# Altium project emote2-gsm_gps-project.PrjPcb
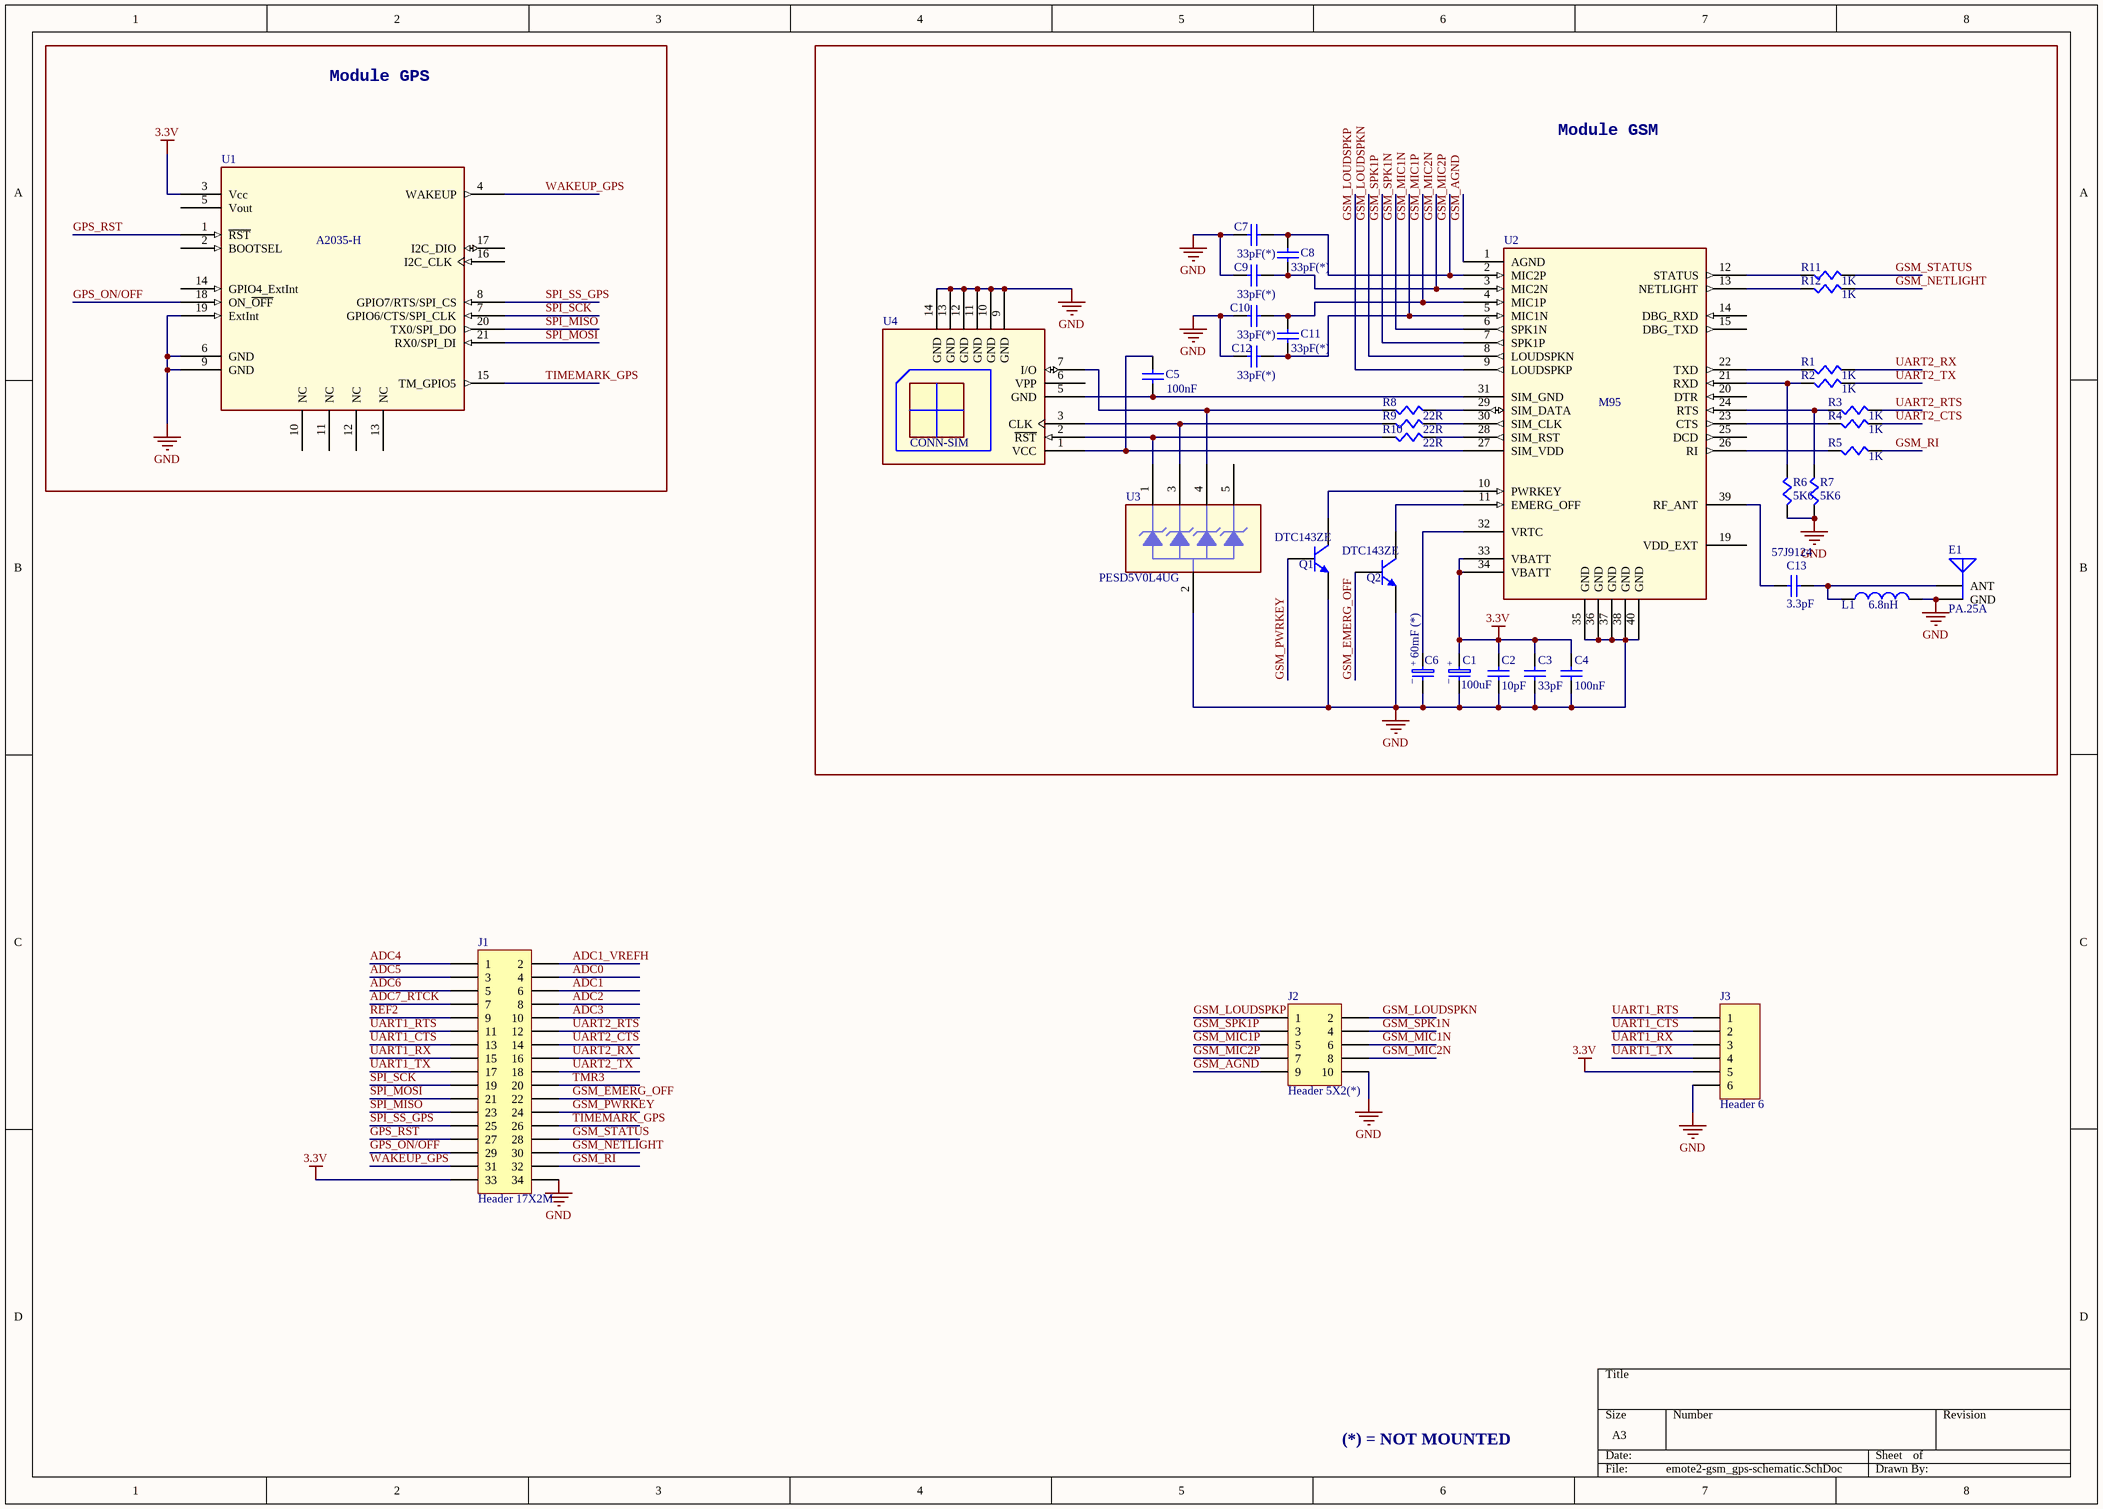
[diagram p0: emote2-gsm_gps-schematic.SchDoc]
1 sheet, 36 parts. Net scope: global (net labels, ports and power ports of the same name join across sheets).
Board file: emote2-gsm_gps-pcb_document.PcbDoc

## Sheet emote2-gsm_gps-schematic.SchDoc
size A3; PageSetup: Record=PageOptions|CenterHorizontal=True|CenterVertical=True|PrintScale=0.69|XCorrection=1.00|YCorrection=1.00|PrintKind=0|BorderSize=5000000|LeftOffset=0|BottomOffset=0|Orientation=2|PaperLength=1000|PaperWidth=1000|Scale=100|PaperSource=7|PrintQuality=-4|MediaType=1|DitherType=10|PaperKind=A4|PrintScaleMode=1

### Parts
C1  100uF  [TC3528-1411]
C2  10pF  [0603]
C3  33pF  [0603]
C4  100nF  [0603]
C5  100nF  [0603]
C6  60mF (*)  [PAS414HR-VE5R]  (no BOM)
C7  33pF(*)  [0603]  (no BOM)
C8  33pF(*)  [0603]  (no BOM)
C9  33pF(*)  [0603]  (no BOM)
C10  33pF(*)  [0603]  (no BOM)
C11  33pF(*)  [0603]  (no BOM)
C12  33pF(*)  [0603]  (no BOM)
C13  3.3pF  Supplier Part Number 1: 57J9124  [0402]
E1  PA.25A  [PA-25A_ANTENA]
J1  Header 17X2M  [FTR-117-D-BOTTOM]
J2  Header 5X2(*)  [BB080 2x5 CON]  (no BOM)
J3  Header 6  [MHDR1X6]
L1  6.8nH  [0402]
Q1  DTC143ZE  [SOT416-3L]
Q2  DTC143ZE  [SOT416-3L]
R1  1K  [0402]
R2  1K  [0402]
R3  1K  [0402]
R4  1K  [0402]
R5  1K  [0402]
R6  5K6  [0402]
R7  5K6  [0402]
R8  22R  [0402]
R9  22R  [0402]
R10  22R  [0402]
R11  1K  [0402]
R12  1K  [0402]
U1  A2035-H  [A2035-H]
U2  M95  [M95]
U3  PESD5V0L4UG  [SOT353/SC-88A]
U4  CONN-SIM  [MICRO-SIM]

### Blocks framed on the sheet
Module GPS: U1
Module GSM: C1-C13 E1 L1 Q1 Q2 R1-R12 U2-U4

### Nets
3.3V: C1.1 C2.2 C3.2 C4.2 J1.33 J3.5 U1.3(Vcc) U2.33(VBATT) U2.34(VBATT)
GND: C1.2 C2.1 C3.1 C4.1 C6.2 C7.1 C9.1 C10.1 C12.1 E1.2(GND) J1.34 J2.10 J3.6 L1.2 Q1.3(E) Q2.3(E) R6.1 R7.1 U1.6(GND) U1.9(GND) U1.19(ExtInt) U2.35(GND) U2.36(GND) U2.37(GND) U2.38(GND) U2.40(GND) U3.2 U4.9(GND) U4.10(GND) U4.11(GND) U4.12(GND) U4.13(GND) U4.14(GND)
ADC0: J1.4
ADC1: J1.6
ADC1_VREFH: J1.2
ADC2: J1.8
ADC3: J1.10
ADC4: J1.1
ADC5: J1.3
ADC6: J1.5
ADC7_RTCK: J1.7
GPS_ON/OFF: J1.29 U1.18(ON_~{OFF})
GPS_RST: J1.27 U1.1(~{RST})
GSM_AGND: J2.9 U2.1(AGND)
GSM_EMERG_OFF: J1.22 Q2.1(B)
GSM_LOUDSPKN: J2.2 U2.8(LOUDSPKN)
GSM_LOUDSPKP: J2.1 U2.9(LOUDSPKP)
GSM_MIC1N: C11.1 C12.2 J2.6 U2.5(MIC1N)
GSM_MIC1P: C10.2 C11.2 J2.5 U2.4(MIC1P)
GSM_MIC2N: C8.1 C9.2 J2.8 U2.3(MIC2N)
GSM_MIC2P: C7.2 C8.2 J2.7 U2.2(MIC2P)
GSM_NETLIGHT: J1.30 R12.2
GSM_PWRKEY: J1.24 Q1.1(B)
GSM_RI: J1.32 R5.2
GSM_SPK1N: J2.4 U2.6(SPK1N)
GSM_SPK1P: J2.3 U2.7(SPK1P)
GSM_STATUS: J1.28 R11.2
REF2: J1.9
SPI_MISO: J1.23 U1.20(TX0/SPI_DO)
SPI_MOSI: J1.21 U1.21(RX0/SPI_DI)
SPI_SCK: J1.19 U1.7(GPIO6/CTS/SPI_CLK)
SPI_SS_GPS: J1.25 U1.8(GPIO7/RTS/SPI_CS)
TIMEMARK_GPS: J1.26 U1.15(TM_GPIO5)
TMR3: J1.20
UART1_CTS: J1.13 J3.2
UART1_RTS: J1.11 J3.1
UART1_RX: J1.15 J3.3
UART1_TX: J1.17 J3.4
UART2_CTS: J1.14 R4.2
UART2_RTS: J1.12 R3.2
UART2_RX: J1.16 R1.2
UART2_TX: J1.18 R2.2
WAKEUP_GPS: J1.31 U1.4(WAKEUP)
NetC5_1: C5.1 U2.31(SIM_GND) U4.5(GND)
NetC5_2: C5.2 U2.27(SIM_VDD) U4.1(VCC)
NetC6_1: C6.1 U2.32(VRTC)
NetC13_1: C13.1 U2.39(RF_ANT)
NetC13_2: C13.2 E1.1(ANT) L1.1
NetQ1_2: Q1.2(C) U2.10(PWRKEY)
NetQ2_2: Q2.2(C) U2.11(EMERG_OFF)
NetR1_1: R1.1 U2.22(TXD)
NetR2_1: R2.1 R6.2 U2.21(RXD)
NetR3_1: R3.1 R7.2 U2.24(RTS)
NetR4_1: R4.1 U2.23(CTS)
NetR5_1: R5.1 U2.26(RI)
NetR8_1: R8.1 U3.4 U4.7(I/O)
NetR8_2: R8.2 U2.29(SIM_DATA)
NetR9_1: R9.1 U3.3 U4.3(CLK)
NetR9_2: R9.2 U2.30(SIM_CLK)
NetR10_1: R10.1 U3.1 U4.2(~{RST})
NetR10_2: R10.2 U2.28(SIM_RST)
NetR11_1: R11.1 U2.12(STATUS)
NetR12_1: R12.1 U2.13(NETLIGHT)

Not connected (* = marked no-connect by the designer): E1 3(NC) 4(NC); U1 2(BOOTSEL) 5(Vout) 10(NC) 11(NC) 12(NC) 13(NC) 14(GPIO4_ExtInt) 16(I2C_CLK) 17(I2C_DIO) 22(GND) 23(GND) 24(GND) 25(GND) 26(GND) 27(GND) 28(GND) 29(GND); U2 14(DBG_RXD) 15(DBG_TXD) 16(NC) 17(NC) 18(NC) 19(VDD_EXT) 20(DTR) 25(DCD) 41(NC) 42(NC); U3 5; U4 4(NC) 6(VPP) 8(NC)

### Notes on the sheet
- (*) = NOT MOUNTED
- (in symbol C-POL) +; _

### Library data of the parts
C1 = C-POL: Capacitor Polarised; Manufacturer: Kemet; Manufacturer Part Number: T495B107M006ATE700; Manufacturer Size Code: B; Description: CAP TANT 100UF 6.3V 20% 1411; ESR (Equivalent Series Resistance): 700 mOhm; Tolerance: ±20%; Type: Molded; Capacitance: 100µF; Voltage - Rated: 6.3V; Supplier 1: Digi-Key; Supplier Part Number 1: 399-3875-6-ND; Category: Capacitors; Supplier: Mouser; Supplier Part Number: T495B107M006ATE700; RoHS: RoHS Compliant; Mounting Type: Surface Mount; Size / Dimension: 0.138" L x 0.110" W (3.50mm x 2.80mm); Operating Temperature: -55°C ~ 125°C; Height - Seated (Max): 0.083" (2.10mm); Package / Case: 1411 (3528 Metric); Lead Spacing: -; Packaging: Cut Tape (CT); Features: General Purpose; Lifetime @ Temp.: -; Price: 1.50
C2 = C0603C10pF: CAP CERAMIC 10pF 25V X5R 0603; Manufacturer Part Number: VJ0603A100JXACW1BC; Manufacturer: VISHAY BC COMPONENTS; Capacitance: 10; Dielectric Characteristic: C0G / NP0; Voltage Rating: 50; No. of Pins: 2; Capacitance Tolerance: ± 5%; Capacitor Terminals: SMD; Capacitor Case Style: 0603 [1608 Metric]; Description: VISHAY BC COMPONENTS - VJ0603A100JXACW1BC - CAPACITOR CERAMIC 10PF 50V, C0G, 5%, 0603; Supplier: Mouser; Price: 0.06; Supplier Part Number: 77-VJ0603A100JXACBC; RoHS: YES; Supplier 1: Newark; Supplier Part Number 1: 57J8481
C3 = C0603C33pF: CAP CERAMIC 33pF 25V X5R 0603; Manufacturer: VISHAY VITRAMON; Manufacturer Part Number: VJ0603A330JXACW1BC; Description: VISHAY VITRAMON - VJ0603A330JXACW1BC - CAPACITOR CERAMIC 33PF 50V, C0G, 5%, 0603; Capacitance: 33; Dielectric Characteristic: C0G / NP0; Capacitance Tolerance: ± 5%; Capacitor Case Style: 0603 [1608 Metric]; Voltage Rating: 50; Capacitor Terminals: SMD; Supplier Part Number: 77-VJ0603A330JXACBC; Supplier: Mouser; Price: 0.06; RoHS: YES; Supplier 1: Newark; Supplier Part Number 1: 57J9194
C4 = C0603C100nF: CAP CERAMIC 100nF 6.3V X5R 0603; Manufacturer Part Number: VJ0603Y104JXJCW1BC; Manufacturer: VISHAY VITRAMON; Description: VISHAY VITRAMON - VJ0603Y104JXJAC - CAPACITOR CERAMIC, 0.1UF, 16V, X7R, 5%, 0603; Supplier Part Number: 77-VJ0603Y104JXJCBC; Supplier: Mouser; Price: 0.06; RoHS: YESX; Supplier 1: Newark; Supplier Part Number 1: 07J8667
C5 = C0603C100nF: CAP CERAMIC 100nF 6.3V X5R 0603; Manufacturer: VISHAY VITRAMON; Manufacturer Part Number: VJ0603Y104JXJCW1BC; Description: VISHAY VITRAMON - VJ0603Y104JXJAC - CAPACITOR CERAMIC, 0.1UF, 16V, X7R, 5%, 0603; RoHS: YESX; Supplier Part Number: 77-VJ0603Y104JXJCBC; Supplier: Mouser; Price: 0.06; Supplier 1: Newark; Supplier Part Number 1: 07J8667
C6 = C-POL: Capacitor Polarised; Manufacturer: TAIYO YUDEN; Description: TAIYO YUDEN - PAS414HR-VE5R - CAP,0.06F, 3.3V, 80 OHM, 4.8MM COIN; Capacitor Terminals: SMD; ESR: 80; Capacitor Case Style: Coin; Capacitance: 60000; Voltage Rating: 3.3; Supplier: Newark; RoHS: YES; Manufacturer Part Number: PAS414HR-VE5R; Supplier Part Number: 12T3294; Operating Temperature Max: 60; Operating Temperature Min: -20; Capacitance Tolerance: -; Supplier 1: Newark; Supplier Part Number 1: 12T3294; Price: 1.18
C7-C12 = CAP: Capacitor; Manufacturer Part Number: MCCA000198; Manufacturer: MULTICOMP; Description: MULTICOMP - MCCA000198 - CAP, CERAMIC, 33PF, 50V, C0G / NP0, 0603; Capacitance Tolerance: ± 5%; No. of Pins: 2; Capacitance: 33; Capacitor Terminals: SMD; Voltage Rating: 25; Dielectric Characteristic: C0G / NP0; Capacitor Case Style: 0201 [0603 Metric]; RoHS: YES; Supplier: Newark; Supplier Part Number: 33R0423; Supplier 1: Newark; Supplier Part Number 1: 33R0423
C13 = CAP: CAP CERAMIC 3.3pF 50V X5R 0402; Manufacturer: VISHAY VITRAMON; Manufacturer Part Number: VJ0603A3R3CXACW1BC; Description: VISHAY VITRAMON - VJ0603A3R3CXACW1BC - CAPACITOR CERAMIC 3.3PF 50V, C0G, 0.25pF, 0603; Capacitance Tolerance: ± 0.25; Capacitor Terminals: SMD; Capacidad: 3.3; Característica dieléctrica: C0G / NP0; N.º of Pins: 2; Capacitor Case Style: 0603 [1608 Metric]; Voltage Rating: 50; Supplier: Mouser; RoHS: YES; Supplier Part Number: 77-VJ0603A3R3CXACBC; Price: 0.06; Capacitance: 3.3; Dielectric Characteristic: C0G / NP0; Supplier 1: Newark
E1 = ANTENNA-PA25A: ANTENNA 6-BAND SMT; Manufacturer: Taoglas Limited; Gain: 1.76dBi, 4.62dBi; Frequency: 824MHz ~ 960MHz, 1.7GHz ~ 2.17GHz; VSWR: 3; Number of Bands: 6; Antenna Type: Chip; Termination: Surface Mount; RoHS: RoHS Compliant; Category: RF/IF and RFID; Packaging: Cut Tape (CT); Manufacturer Part Number: PA.25A; Height (Max): 5mm; Mounting Type: Surface Mount; Supplier 1: Digi-Key; Supplier Part Number 1: 931-1060-1-ND; Supplier: Mouser; Supplier Part Number: 960-PA25A; Price: 11.34
J1 = Header 17X2M: SAMTEC - FTR-117-03-S-D - HEADER, 1.27 X 2.54MM, SMD, 2X17POS; Pitch Spacing: 1.27; Contact Termination: Surface Mount Vertical; No. of Rows: 2; No. of Contacts: 34; Contact Plating: Gold; Series: -; Contact Material: Phosphor Bronze; Manufacturer Part Number: FTR-117-03-S-D; Gender: Header; RoHS: YES; Manufacturer: SAMTEC; Supplier Part Number: 84T3738; Supplier: Newark; Supplier 1: Newark; Supplier Part Number 1: 84T3738; Price: 5.64
J2 = Header 5X2: Header, 5-Pin, Dual row; Manufacturer: GLOBAL CONNECTOR TECHNOLOGY; Manufacturer Part Number: BB080-10-A-0-0270-0150-L-D; Description: GLOBAL CONNECTOR TECHNOLOGY - BB080-10-A-0-0270-0150-L-D - BOARD-BOARD CONN, HEADER, 10WAY, 2ROW; Supplier Part Number: 67R6815; RoHS: YES; Supplier: Newark; Supplier 1: Newark; Supplier Part Number 1: 67R6815
J3 = Header 6: Header, 6-Pin; Manufacturer Part Number: BD020-06-A-J-0350-0300-L-G; Manufacturer: GLOBAL CONNECTOR TECHNOLOGY; Description: GLOBAL CONNECTOR TECHNOLOGY - BD020-06-A-J-0350-0300-L-G - BOARD-BOARD CONNECTOR HEADER, 6WAY, 1ROW; No. of Contacts: 6; No. of Rows: 1; Pitch Spacing: 1.27; Contact Termination: Through Hole Vertical; Series: -; Supplier Part Number: 67R7288; Supplier: Newark; Gender: Header; RoHS: YES; Contact Plating: Gold; Contact Material: Copper Alloy; Supplier 1: Newark; Supplier Part Number 1: 67R7288; Price: 0.45
L1 = 74477420: INDUCTOR POWER 100UH .57A SMD; Manufacturer: TAIYO YUDEN; Manufacturer Part Number: HK10056N8J-T; Description: TAIYO YUDEN - HK10056N8J-T - SMD INDUCTOR, 6.8NH 180MA 5% 5.5GHZ; Supplier Part Number: 963-HK10056N8J-T; Supplier: Mouser; Supplier 1: Newark; Supplier Part Number 1: 86H5548; RoHS: YES; Price: 0.05
Q1 Q2 = T-DTC143Z: NPN General Purpose Amplifier; Manufacturer Part Number: PDTC143ZE,115; Manufacturer: NXP; Description: NXP - PDTC143ZE,115 - BRT TRANSISTOR, NPN, 50V, 100MA, 4.7KOHM / 47KOHM, 3-SOT-416; Resistor Ratio, R1 / R2: 10; Base Input Resistor R1: 4.7; Continuous Collector Current Ic: 100; Collector Emitter Voltage V(br)ceo: 50; Base-Emitter Resistor R2: 47; Supplier Part Number: 771-PDTC143ZE115; Supplier: Mouser; RoHS: YES; Supplier 1: Newark; Supplier Part Number 1: 75R0820; Price: 0.18
R1-R5 = R-1K-0402: RES 1K OHM 1/16W 0402 SMD; Manufacturer: VISHAY DALE; Manufacturer Part Number: CRCW04021K00JNED; Description: VISHAY DALE - CRCW04021K00JNED - RESISTOR, THICK FILM CHIP, 1KOHM 63mW, 5%; Resistance: 1; Power Rating: 63; Product Range: VISHAY DALE - CRCW Series Thick Film Chip Resistor; Resistance Tolerance: ± 5%; Voltage Rating: 50; Resistor Case Style: 0402 [1005 Metric]; Supplier 1: Newark; Supplier Part Number 1: 59M6691; Supplier: Mouser; Supplier Part Number: 71-CRCW0402J-1.0K-E3; RoHS: YES; Price: 0.03
R6 R7 = R-5K6-0402: RES 5K6 OHM 1/16W 0402 SMD; Manufacturer Part Number: CRCW04025K60FKED; Manufacturer: VISHAY DALE; Resistance: 5.6; Product Range: VISHAY DALE - CRCW Series Thick Film Chip Resistor; Voltage Rating: 50; Resistor Case Style: 0402 [1005 Metric]; Resistance Tolerance: ± 1%; Power Rating: 63; Description: VISHAY DALE - CRCW04025K60FKED - RESISTOR, THICK FILM, 5.6KOHM, 63mW, 1%; Supplier 1: Newark; Supplier: Mouser; RoHS: YES; Supplier Part Number 1: 72M6799; Supplier Part Number: 71-CRCW04025K60FKED; Price: 0.03
R8-R10 = R-22-0402: RES 22 OHM 1/16W 0402 SMD; Manufacturer: VISHAY DALE; Manufacturer Part Number: CRCW040222R0FKED; Voltage Rating: 50; Resistor Case Style: 0402 [1005 Metric]; Description: VISHAY DALE - CRCW040222R0FKED - RESISTOR, THICK FILM CHIP, 22 OHM 63mW, 1%; Resistance: 22; Product Range: VISHAY DALE - CRCW Series Thick Film Chip Resistor; Resistance Tolerance: ± 1%; Power Rating: 63; Supplier 1: Newark; Supplier Part Number 1: 52K6847; Supplier: Mouser; RoHS: YESX; Supplier Part Number: 71-CRCW0402-22-E3; Price: 0.03
R11 R12 = R-SMD-0402: RES 1/16W 0402 SMD; Manufacturer Part Number: CRCW04021K00JNED; Manufacturer: VISHAY DALE; Description: VISHAY DALE - CRCW04021K00JNED - RESISTOR, THICK FILM CHIP, 1KOHM 63mW, 5%; Supplier 1: Newark; Supplier Part Number 1: 59M6691; Supplier Part Number: 71-CRCW0402J-1.0K-E3; RoHS: YES; Supplier: Mouser; Price: 0.03
U1 = A2035-H: GPS Receiver + Antenna; Manufacturer Part Number: A2035H; Manufacturer: MAESTRO WIRELESS SOLUTIONS; Description: MAESTRO WIRELESS SOLUTIONS - A2035H - GPS MODULE, W/ ANT, SIRF IV; No. of Channels: 48; Module Interface: I2; Protocol: NMEA, SiRF Binary; Position Accuracy: 2.5?; Supply Voltage Max: 3.6; Supply Voltage Min: 3; Frequency RF: 1.575; Supplier Part Number: 61W8576; Supplier: Newark; Supply Voltage Range: 3; RoHS: YES; Supplier 1: Newark; Supplier Part Number 1: 61W8576; Price: 34.76
U2 = GSM-M95: M95 Quectel Cellular Engine; Manufacturer Part Number: M95; Supplier Part Number: M95; Manufacturer: QUECTEL; Supplier: Quectel; Price: 25.00
U3 = PESD5V0L4UG: Very low capacitance unidirectional quadruple ESD protection diode arrays; Manufacturer Part Number: PESD5V0L4UG,115; Manufacturer: NXP Semiconductors; Polarization: 4 Channel Array - Unidirectional; Power (Watts): 30W; Voltage - Reverse Standoff (Typ): 5V; Voltage - Breakdown: 6.46V; Description: DIODE LOW ESD PROTECTION SOT353; Category: Circuit Protection; Mounting Type: Surface Mount; Supplier Device Package: SOT-353; Package / Case: 6-TSSOP (5 Lead), SC-88A, SOT-353; RoHS: RoHS Compliant; Supplier: Mouser; Packaging: Cut Tape (CT); Supplier Part Number: 771-PESD5V0L4UG-T/R; Supplier 1: Digi-Key; Supplier Part Number 1: 568-4051-1-ND; Price: 0.41
U4 = CONN-SIM: Micro SIM Connector 1.45mm, Push Pull; Manufacturer Part Number: 0786463001; Manufacturer: Molex Inc; Description: CONN MICRO-SIM 6POS R/A SMD; Insertion, Removal Method: Push In, Pull Out; Number of Positions: 6; Supplier 1: Digi-Key; Supplier Part Number 1: WM9364CT-ND; Category: Connectors, Interconnects; Supplier Part Number: 538-78646-3001; Supplier: Mouser; RoHS: RoHS Compliant; Card Type: Micro SIM; Connector Type: Connector; Mounting Feature: Normal, Standard - Top; Mounting Type: Surface Mount, Right Angle; Height Above Board: 0.057" (1.45mm); Contact Finish Thickness: 15µin (0.38µm); Packaging: Cut Tape (CT); Contact Finish: Gold; Price: 1.03